# EAGLE design Robot Board ++ (EAGLE 6.4)
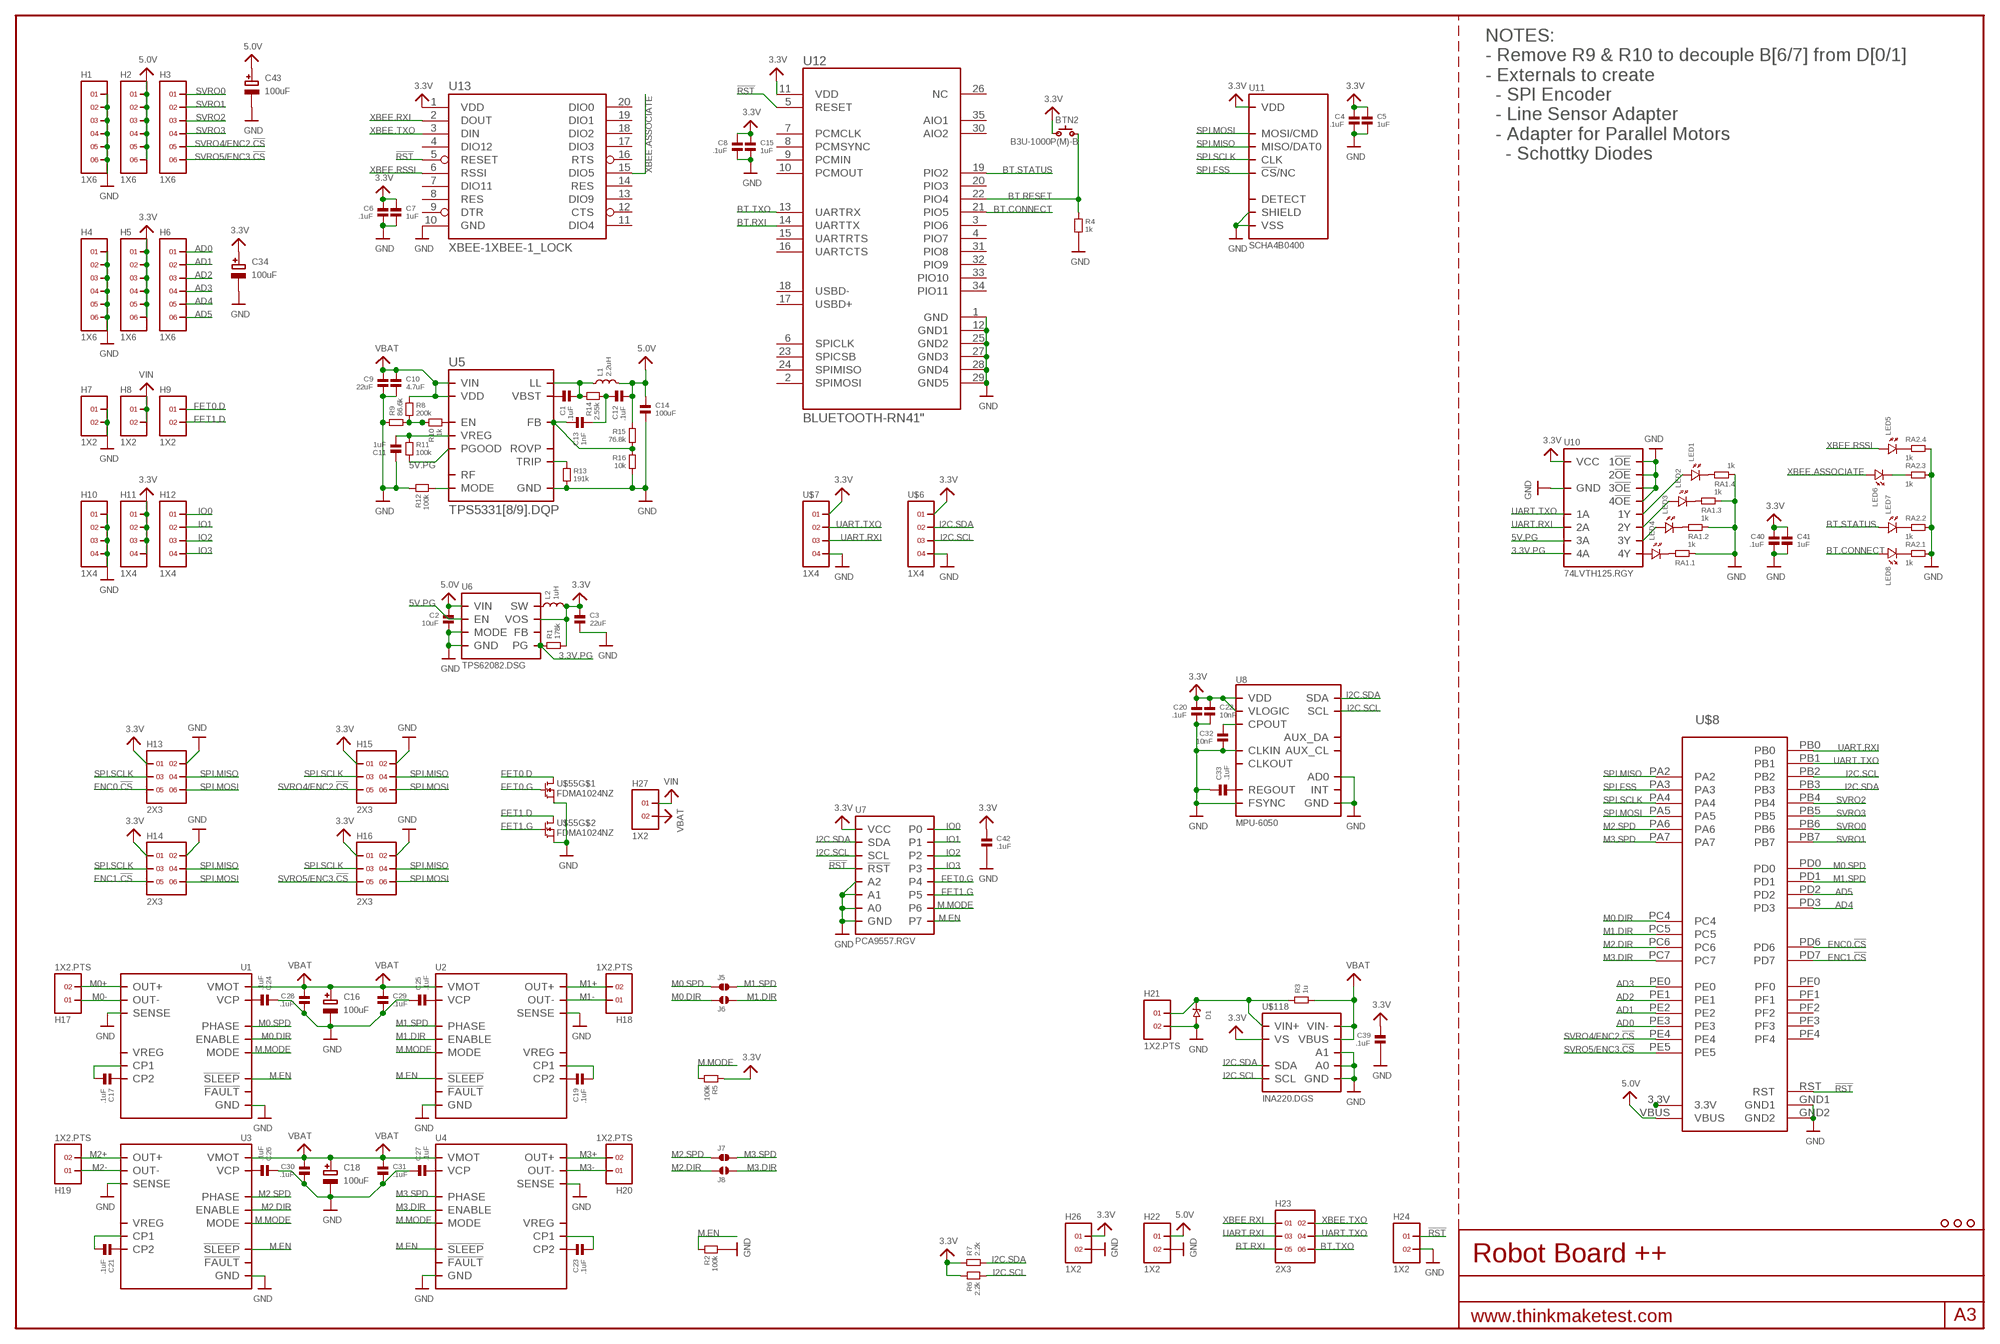
[diagram p0: schematic, sheet 1]

## Parts
BTN2  B3U-1000P(M)-B  SPST.B3U-1000P(M)-B  [B3U-1000P(M)-B]
C1  .1uF  CAPACITOR.0603  [0603]
C2  10uF  CAPACITOR.0603  [0603]
C3  22uF  CAPACITOR.0603  [0603]
C4  .1uF  CAPACITOR.0603  [0603]
C5  1uF  CAPACITOR.0603  [0603]
C6  .1uF  CAPACITOR.0603  [0603]
C7  1uF  CAPACITOR.0603  [0603]
C8  .1uF  CAPACITOR.0603  [0603]
C9  22uF  CAPACITOR.1206  [1206]
C10  4.7uF  CAPACITOR.0805  [0805]
C11  1uF  CAPACITOR.0603  [0603]
C12  .1uF  CAPACITOR.0603  [0603]
C13  1nF  CAPACITOR.0603  [0603]
C14  100uF  CAPACITOR.1210  [1210]
C15  1uF  CAPACITOR.0603  [0603]
C16  100uF  CAP_ELECTROLYTICPANASONIC_C  [PANASONIC_C]
C17  .1uF  CAPACITOR.0603  [0603]
C18  100uF  CAP_ELECTROLYTICPANASONIC_C  [PANASONIC_C]
C19  .1uF  CAPACITOR.0603  [0603]
C20  .1uF  CAPACITOR.0603  [0603]
C21  .1uF  CAPACITOR.0603  [0603]
C22  10nF  CAPACITOR.0603  [0603]
C23  .1uF  CAPACITOR.0603  [0603]
C24  .1uF  CAPACITOR.0603  [0603]
C25  .1uF  CAPACITOR.0603  [0603]
C26  .1uF  CAPACITOR.0603  [0603]
C27  .1uF  CAPACITOR.0603  [0603]
C28  .1uF  CAPACITOR.0603  [0603]
C29  .1uF  CAPACITOR.0603  [0603]
C30  .1uF  CAPACITOR.0603  [0603]
C31  .1uF  CAPACITOR.0603  [0603]
C32  10nF  CAPACITOR.0603  [0603]
C33  .1uF  CAPACITOR.0603  [0603]
C34  100uF  CAP_ELECTROLYTICPANASONIC_C  [PANASONIC_C]
C39  .1uF  CAPACITOR.0603  [0603]
C40  .1uF  CAPACITOR.0603  [0603]
C41  1uF  CAPACITOR.0603  [0603]
C42  .1uF  CAPACITOR.0603  [0603]
C43  100uF  CAP_ELECTROLYTICPANASONIC_C  [PANASONIC_C]
D1  DIODE[SCHOTKY]-SOD123W  [SOD123W]
H1  1X6  [1X6]
H2  1X6  [1X6]
H3  1X6  [1X6]
H4  1X6  [1X6]
H5  1X6  [1X6]
H6  1X6  [1X6]
H7  1X2  [1X2]
H8  1X2  [1X2]
H9  1X2  [1X2]
H10  1X4  [1X4]
H11  1X4  [1X4]
H12  1X4  [1X4]
H13  2X3  [2X3@1]
H14  2X3  [2X3@1]
H15  2X3  [2X3@1]
H16  2X3  [2X3@1]
H17  1X2.PTS  1X2.PTS.PLUG  [PTS.PLUG]
H18  1X2.PTS  1X2.PTS.PLUG  [PTS.PLUG]
H19  1X2.PTS  1X2.PTS.PLUG  [PTS.PLUG]
H20  1X2.PTS  1X2.PTS.PLUG  [PTS.PLUG]
H21  1X2.PTS  1X2.PTS.PLUG  [PTS.PLUG]
H22  1X2  [1X2]
H23  2X3  [2X3]
H24  1X2  [1X2]
H26  1X2  [1X2]
H27  1X2  [1X2]
J5  SOLDERJUMPER.2.LRG  [2.LRG]
J6  SOLDERJUMPER.2.LRG  [2.LRG]
J7  SOLDERJUMPER.2.LRG  [2.LRG]
J8  SOLDERJUMPER.2.LRG  [2.LRG]
L1  2.2uH  INDUCTOR.XAL6030  [XAL6030]
L2  1uH  INDUCTOR-SRN3015  [SRN3015]
LED1  LED.0603  [0603.LED]
LED2  LED.0603  [0603.LED]
LED3  LED.0603  [0603.LED]
LED4  LED.0603  [0603.LED]
LED5  LED.0603  [0603.LED]
LED6  LED.0603  [0603.LED]
LED7  LED.0603  [0603.LED]
LED8  LED.0603  [0603.LED]
R1  178k  RESISTOR.0603  [0603]
R2  100k  RESISTOR.0603  [0603]
R3  1u  RESISTOR.WSK  [0612]
R4  1k  RESISTOR.0603  [0603]
R5  100k  RESISTOR.0603  [0603]
R6  2.2k  RESISTOR.0603  [0603]
R7  2.2k  RESISTOR.0603  [0603]
R8  200k  RESISTOR.0603  [0603]
R9  86.6k  RESISTOR.0603  [0603]
R10  1k  RESISTOR.0603  [0603]
R11  100k  RESISTOR.0603  [0603]
R12  100k  RESISTOR.0603  [0603]
R13  191k  RESISTOR.0603  [0603]
R14  2.55k  RESISTOR.0603  [0603]
R15  76.8k  RESISTOR.0603  [0603]
R16  10k  RESISTOR.0603  [0603]
RA1  1k  RA-4.0603  [0603.4.C]
RA2  1k  RA-4.0603  [0603.4.C]
U1  DRV8800.RTY  [RTY.16]
U2  DRV8800.RTY  [RTY.16]
U3  DRV8800.RTY  [RTY.16]
U4  DRV8800.RTY  [RTY.16]
U5  TPS5331[8/9].DQP  [DQP.22]
U6  TPS62082.DSG  TPS6208X.DSG  [DSG]
U7  PCA9557.RGV  [RGV.16]
U8  MPU-6050  [QFN.24.4X4]
U10  74LVTH125.RGY  74XX125.RGY  [RGY.14]
U11  SCHA4B0400  [SCHA4B0400]
U12  BLUETOOTH-RN41"  [RN41]
U13  XBEE-1XBEE-1_LOCK  [XBEE-1_LOCK]
U$3  HOLE.4MM  [4MM]
U$4  HOLE.4MM  [4MM]
U$6  1X4  [1X4]
U$7  1X4  [1X4]
U$8  STELLARIS-LAUNCHPADSTELLARIS-LAUNCHPAD-XL  [LAUNCHPAD-XL]
U$11  HOLE.4MM  [4MM]
U$55  FDMA1024NZ  [MICROFET.2X2]
U$118  INA220.DGS  [DGS.10]

## Nets
3.3V: BTN2.2 C3.1 C4.1 C5.1 C6.1 C7.1 C8.1 C15.1 C20.1 C22.1 C34.+ C39.1 C40.1 C41.1 C42.1 H5.1 H5.2 H5.3 H5.4 H5.5 H5.6 H11.1 H11.2 H11.3 H11.4 H13.1 H14.1 H15.1 H16.1 H26.1 L2.2 R1.2 R5.1 R6.1 R7.1 U6.5(VOS) U7.14(VCC) U8.8(VLOGIC) U8.13(VDD) U10.14(VCC) U11.VDD U12.11(VDD) U13.1(VDD) U$6.1 U$7.1 U$118.6(VS)
3.3V.PG: R1.1 U6.6(PG) U10.12(4A)
5.0V: C2.1 C12.2 C14.1 C43.+ H2.1 H2.2 H2.3 H2.4 H2.5 H2.6 H22.1 L1.2 R15.1 U6.8(VIN) U$8.VBUS
5V.PG: R11.2 U5.3(PGOOD) U6.1(EN) U10.9(3A)
!RST: H24.1 U7.13(!RST) U12.5(RESET) U13.5(RESET) U$8.RST
AD0: H6.1 U$8.PE3
AD1: H6.2 U$8.PE2
AD2: H6.3 U$8.PE1
AD3: H6.4 U$8.PE0
AD4: H6.5 U$8.PD3
AD5: H6.6 U$8.PD2
BT.CONNECT: LED8.P$1 U12.21(PIO5)
BT.RESET: BTN2.1 R4.1 U12.22(PIO4)
BT.RXI: H23.5 U12.14(UARTTX)
BT.STATUS: LED7.P$1 U12.19(PIO2)
BT.TXO: H23.6 U12.13(UARTRX)
ENC0.!CS: H13.5 U$8.PD6
ENC1.!CS: H14.5 U$8.PD7
FET0.D: H9.1 U$55.6(D) U$55.PAD@1(D)
FET0.G: U7.9(P4) U$55.2(G)
FET1.D: H9.2 U$55.3(D) U$55.PAD@2(D)
FET1.G: U7.10(P5) U$55.5(G)
GND: C2.2 C3.2 C4.2 C5.2 C6.2 C7.2 C8.2 C9.2 C10.2 C11.1 C14.2 C15.2 C16.- C18.- C20.2 C22.2 C24.1 C25.1 C26.1 C27.1 C28.2 C29.2 C30.2 C31.2 C32.2 C33.1 C34.- C39.2 C40.2 C41.2 C42.2 C43.- D1.P$1 H1.1 H1.2 H1.3 H1.4 H1.5 H1.6 H4.1 H4.2 H4.3 H4.4 H4.5 H4.6 H7.1 H7.2 H10.1 H10.2 H10.3 H10.4 H13.2 H14.2 H15.2 H16.2 H21.2 H22.2 H24.2 H26.2 R2.2 R4.2 R9.1 R12.1 R13.2 R16.2 RA1.1 RA1.3 RA1.5 RA1.7 RA2.2 RA2.4 RA2.6 RA2.8 U1.2(GND) U1.7(SENSE) U1.12(GND) U1.PAD(GND) U2.2(GND) U2.7(SENSE) U2.12(GND) U2.PAD(GND) U3.2(GND) U3.7(SENSE) U3.12(GND) U3.PAD(GND) U4.2(GND) U4.7(SENSE) U4.12(GND) U4.PAD(GND) U5.PAD(GND) U6.2(GND) U6.3(MODE) U6.PAD(GND) U7.1(A0) U7.2(A1) U7.3(A2) U7.6(GND) U7.PAD(GND) U8.1(CLKIN) U8.9(AD0) U8.11(FSYNC) U8.18(GND) U10.1(1!OE) U10.4(2!OE) U10.7(GND) U10.10(3!OE) U10.13(4!OE) U10.PAD(GND) U11.GND(VSS) U11.GND@1(VSS) U11.GND@2(VSS) U11.SHIELD U11.SHIELD@1(SHIELD) U11.SHIELD@2(SHIELD) U11.SHIELD@3(SHIELD) U11.VSS U12.1(GND) U12.12(GND1) U12.25(GND2) U12.27(GND3) U12.28(GND4) U12.29(GND5) U13.10(GND) U$6.4 U$7.4 U$8.GND1 U$8.GND2 U$55.1(S) U$55.4(S) U$118.1(A1) U$118.2(A0) U$118.7(GND)
I2C.SCL: R6.2 U7.15(SCL) U8.23(SCL) U$6.3 U$8.PB2 U$118.5(SCL)
I2C.SDA: R7.2 U7.16(SDA) U8.24(SDA) U$6.2 U$8.PB3 U$118.4(SDA)
IO0: H12.1 U7.4(P0)
IO1: H12.2 U7.5(P1)
IO2: H12.3 U7.7(P2)
IO3: H12.4 U7.8(P3)
M0+: H17.2 U1.6(OUT+)
M0-: H17.1 U1.9(OUT-)
M0.DIR: J6.1 U1.4(ENABLE) U$8.PC4
M0.SPD: J5.1 U1.1(PHASE) U$8.PD0
M1+: H18.2 U2.6(OUT+)
M1-: H18.1 U2.9(OUT-)
M1.DIR: J6.2 U2.4(ENABLE) U$8.PC5
M1.SPD: J5.2 U2.1(PHASE) U$8.PD1
M2+: H19.2 U3.6(OUT+)
M2-: H19.1 U3.9(OUT-)
M2.DIR: J8.1 U3.4(ENABLE) U$8.PC6
M2.SPD: J7.1 U3.1(PHASE) U$8.PA6
M3+: H20.2 U4.6(OUT+)
M3-: H20.1 U4.9(OUT-)
M3.DIR: J8.2 U4.4(ENABLE) U$8.PC7
M3.SPD: J7.2 U4.1(PHASE) U$8.PA7
M.EN: R2.1 U1.3(!SLEEP) U2.3(!SLEEP) U3.3(!SLEEP) U4.3(!SLEEP) U7.12(P7)
M.MODE: R5.2 U1.16(MODE) U2.16(MODE) U3.16(MODE) U4.16(MODE) U7.11(P6)
N$1: U$8.3.3V
N$2: C1.1 U5.4(VBST)
N$3: R12.2 U5.20(MODE)
N$4: C11.2 R11.1 U5.18(VREG)
N$5: R13.1 U5.21(TRIP)
N$6: LED1.P$1 U10.3(1Y)
N$7: C33.2 U8.10(REGOUT)
N$8: R10.2 U5.2(EN)
N$9: LED8.P$2 RA2.1
N$10: C13.1 R15.2 R16.1 U5.1(FB)
N$11: R8.2 R9.2 R10.1
N$12: L2.1 U6.7(SW)
N$13: C17.1 U1.11(CP2)
N$14: C12.1 C13.2 R14.2
N$15: C1.2 L1.1 R14.1 U5.6(LL) U5.7(LL) U5.8(LL) U5.9(LL) U5.10(LL) U5.11(LL)
N$18: C24.2 U1.13(VCP)
N$19: C25.2 U2.13(VCP)
N$20: C26.2 U3.13(VCP)
N$21: C27.2 U4.13(VCP)
N$22: D1.P$2 H21.1 R3.1@1 R3.1@2 U$118.10(VIN+)
N$24: C32.1 U8.20(CPOUT)
N$25: C19.1 U2.11(CP2)
N$27: C21.1 U3.11(CP2)
N$29: C23.1 U4.11(CP2)
N$37: C21.2 U3.10(CP1)
N$38: C17.2 U1.10(CP1)
N$39: C19.2 U2.10(CP1)
N$40: C23.2 U4.10(CP1)
N$43: LED2.P$1 U10.6(2Y)
N$44: LED4.P$1 U10.11(4Y)
N$46: LED7.P$2 RA2.3
N$47: LED6.P$2 RA2.5
N$48: LED5.P$2 RA2.7
N$49: LED4.P$2 RA1.2
N$50: LED3.P$1 U10.8(3Y)
N$51: LED1.P$2 RA1.8
N$52: LED2.P$2 RA1.6
N$53: LED3.P$2 RA1.4
SPI.FSS: U11.!CS!/NC/DAT3(!CS!/NC) U$8.PA3
SPI.MISO: H13.4 H14.4 H15.4 H16.4 U11.MISO/DAT0 U$8.PA2
SPI.MOSI: H13.6 H14.6 H15.6 H16.6 U11.MOSI/CMD U$8.PA5
SPI.SCLK: H13.3 H14.3 H15.3 H16.3 U11.CLK U$8.PA4
SVRO0: H3.1 U$8.PB6
SVRO1: H3.2 U$8.PB7
SVRO2: H3.3 U$8.PB4
SVRO3: H3.4 U$8.PB5
SVRO4/ENC2.!CS: H3.5 H15.5 U$8.PE4
SVRO5/ENC3.!CS: H3.6 H16.5 U$8.PE5
UART.RXI: H23.3 U10.5(2A) U$7.3 U$8.PB0
UART.TXO: H23.4 U10.2(1A) U$7.2 U$8.PB1
VBAT: C9.1 C10.1 C16.+ C18.+ C28.1 C29.1 C30.1 C31.1 H27.2 R3.2@1 R3.2@2 R8.1 U1.8(VMOT) U2.8(VMOT) U3.8(VMOT) U4.8(VMOT) U5.12(VIN) U5.13(VIN) U5.14(VIN) U5.15(VIN) U5.16(VIN) U5.17(VIN) U5.19(VDD) U$118.8(VBUS) U$118.9(VIN-)
VIN: H8.1 H8.2 H27.1
XBEE.ASSOCIATE: LED6.P$1 U13.15(DIO5)
XBEE.RSSI: LED5.P$1 U13.6(RSSI)
XBEE.RXI: H23.1 U13.2(DOUT)
XBEE.TXO: H23.2 U13.3(DIN)
Unconnected: U1.14(VREG) U1.15(!FAULT) U2.14(VREG) U2.15(!FAULT) U3.14(VREG) U3.15(!FAULT) U4.14(VREG) U4.15(!FAULT) U5.5(ROVP) U5.22(RF) U6.4(FB) U8.6(AUX_DA) U8.7(AUX_CL) U8.12(INT) U8.22(CLKOUT) U11.CD(DETECT) U12.2(SPIMOSI) U12.3(PIO6) U12.4(PIO7) U12.6(SPICLK) U12.7(PCMCLK) U12.8(PCMSYNC) U12.9(PCMIN) U12.10(PCMOUT) U12.15(UARTRTS) U12.16(UARTCTS) U12.17(USBD+) U12.18(USBD-) U12.20(PIO3) U12.23(SPICSB) U12.24(SPIMISO) U12.26(NC) U12.30(AIO2) U12.31(PIO8) U12.32(PIO9) U12.33(PIO10) U12.34(PIO11) U12.35(AIO1) U13.4(DIO12) U13.7(DIO11) U13.8(RES) U13.9(DTR) U13.11(DIO4) U13.12(CTS) U13.13(DIO9) U13.14(RES) U13.16(RTS) U13.17(DIO3) U13.18(DIO2) U13.19(DIO1) U13.20(DIO0) U$8.PF0 U$8.PF1 U$8.PF2 U$8.PF3 U$8.PF4

## Notes on the sheet
- NOTES:
  - Remove R9 & R10 to decouple B[6/7] from D[0/1]
  - Externals to create
    - SPI Encoder
    - Line Sensor Adapter
    - Adapter for Parallel Motors
      - Schottky Diodes

## Library data of the parts
BTN2 = omron:SPST
C1-C15 C17 C19-C33 C39-C42 = standardparts:CAPACITOR
C16 C18 C34 C43 = microbuilder:CAP_ELECTROLYTIC: Electrolytic Capacitors SMT PANASONIC_C - Size C Panasonic Electrolytic Aluminum Capacitor 47µF 16V 20% Electrolytic Capacitor [Digikey: PCE3890TR-ND] PANASONIC_D - Size D Panasonic Electrolytic Aluminum Capacitor 100µF 25V 20% Electrolytic Capacitor [Digikey: PCE3898TR-ND] PTH 3.5 mm grid, 8 mm diameter ... 3.5 mm grid, 10 mm diameter ...
D1 = nxp:DIODE[SCHOTKY]
H1-H6 = headers(.1in):1X6
H7-H9 H22 H24 H26 H27 = headers(.1in):1X2
H10-H12 U$6 U$7 = headers(.1in):1X4
H13-H16 = headers(.1in):2X3
H17-H21 = phoenixcontact:1X2
H23 = headers(2mm):2X3
J5-J8 = solderjumper:SOLDERJUMPER.2
L1 = coilcraft:INDUCTOR
L2 = bourns:INDUCTOR
LED1-LED8 = standardparts:LED
R1 R2 R4-R16 = standardparts:RESISTOR
R3 = vishay:RESISTOR
RA1 RA2 = resistorarray:RA-4: Dimentions sources from here: http://www.ctscorp.com/components/Datasheets/CTSChipArrayDs.pdf
U1-U4 = packages(ti):DRV8800
U5 = packages(ti):TPS5331[8/9]
U6 = packages(ti):TPS6208X
U7 = packages(ti):PCA9557
U8 = invensense:MPU-6050
U10 = packages(ti):74XX125
U11 = alps:SCHA4B0400
U12 = SparkFun-RF:BLUETOOTH-RN41: Bluetooth SMD module
U13 = SparkFun-RF:XBEE-1: Xbee module footprints SMT header is CONN-09042.
U$3 U$4 U$11 = screw_holes:HOLE
U$8 = StellarisLaunchPad_Fred:STELLARIS-LAUNCHPAD
U$55 = freescale:FDMA1024NZ
U$118 = packages(ti):INA220

## Board
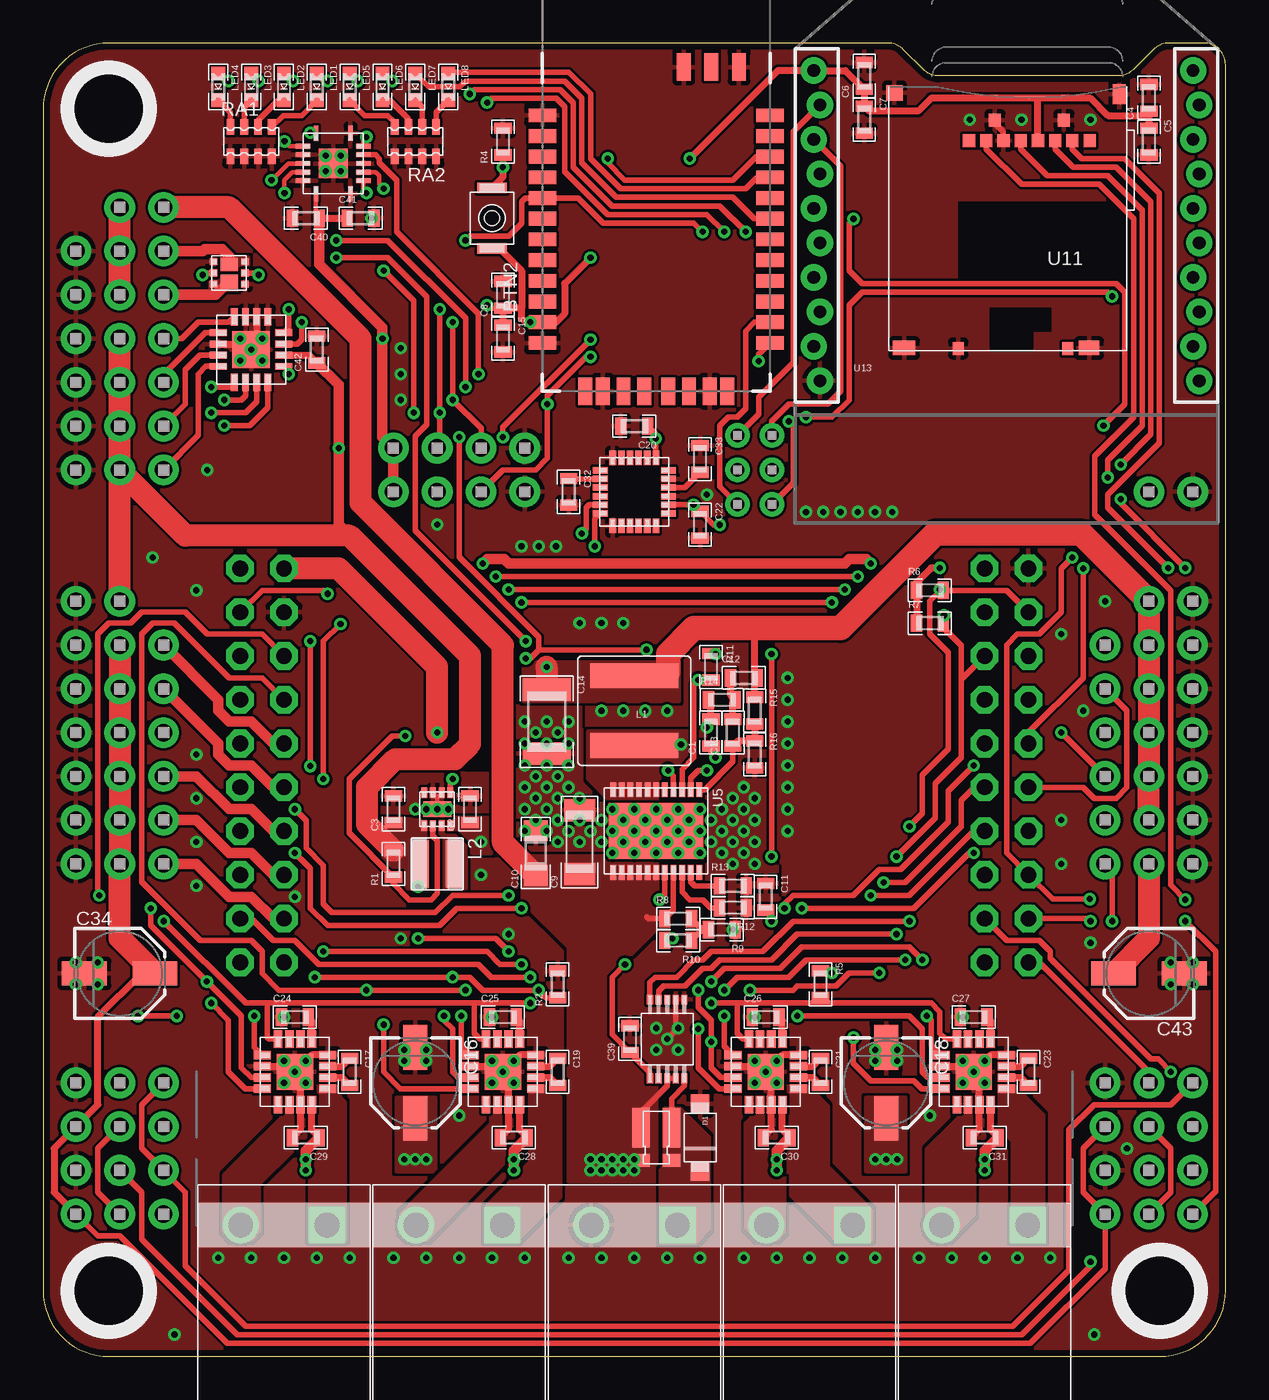
[diagram p1: board, top side]
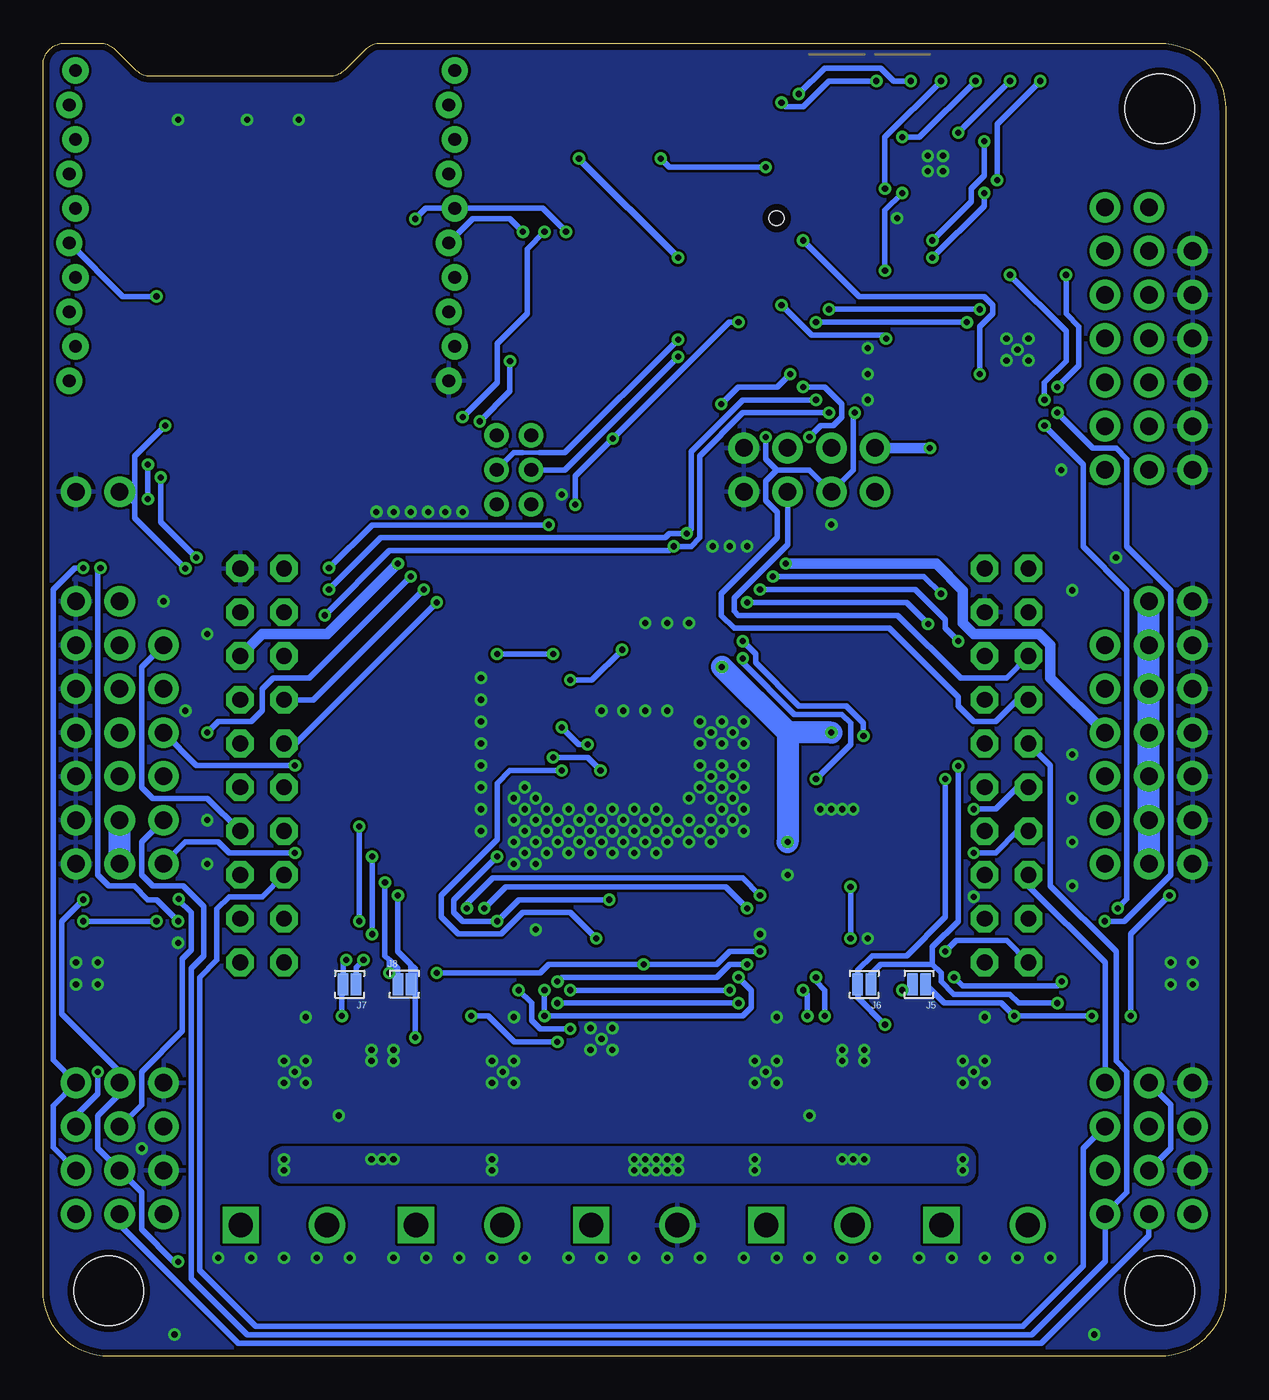
[diagram p2: board, bottom side, seen from below]

Size 68.58 x 76.2 mm. Coordinates in mm from the lower left corner, seen from the top.
Outline: 67.31,76.2 65.3,76.2 arc45 64.4,75.83 63.24,74.67 arc-45 62.34,74.3 51.96,74.3 arc-45 51.06,74.67 49.9,75.83 arc45 49,76.2 3.81,76.2 arc90 0,72.39 0,3.81 arc90 3.81,0 64.77,0 arc90 68.58,3.81 68.58,74.93 arc90 67.31,76.2
Copper layers (1*16): Top 0.0356mm / dielectric 1.5011mm / Bottom 0.0356mm
Design rules "OSHPark": minimum track width 6mil, minimum drill 13mil, track to track 6mil, track to pad 6mil, pad to pad 6mil, via to via 6mil, smd to smd 6mil, copper to edge 15mil, drill to drill 6mil, minimum pad ring 7mil, minimum via ring 7mil, stop-mask expansion 4mil, vias tented up to drill 16mil, thermal gap 10mil
tRestrict: 3 lines

### Footprints (pad centres in the part's own frame; a part is rotated, then mirrored left to right if it is on the bottom)
B3U-1000P(M)-B = smd 0.6 x 1.7: 1 -1.75,0; 2 1.75,0 | hole 0.85: 0,0
0603 = smd 0.65 x 1: 1 -0.775,0; 2 0.775,0
1206 = smd 1.3 x 1.8: 1 -1.85,0; 2 1.85,0
0805 = smd 1.2 x 1.4: 1 -1.3,0; 2 1.3,0
1210 = smd 1.3 x 2.8: 1 -1.85,0; 2 1.85,0
PANASONIC_C = smd 2.6 x 1.4: + 2.05,0; - -2.05,0
SOD123W = smd 1.1 x 1.1: P$1 -1.95,0; P$2 1.95,0
1X6 = drill 1.016 pad 1.778: 1 0,0; 2 2.54,0; 3 5.08,0; 4 7.62,0; 5 10.16,0; 6 12.7,0
1X2 = drill 1.016 pad 1.778: 1 0,0; 2 2.54,0
1X4 = drill 1.016 pad 1.778: 1 0,0; 2 2.54,0; 3 5.08,0; 4 7.62,0
2X3 = drill 1.016 pad 1.778: 1 0,0; 2 0,2.54; 3 2.54,0; 4 2.54,2.54; 5 5.08,0; 6 5.08,2.54
PTS.PLUG = drill 1.4 square: 1 -2.5,0 | drill 1.4: 2 2.5,0
2X3' = drill 0.8 pad 1.422: 1 -2,-1; 2 -2,1; 3 0,-1; 4 0,1; 5 2,-1; 6 2,1
2.LRG = smd 0.61 x 1.27: 1 -0.381,0; 2 0.381,0
XAL6030 = smd 1.43 x 5.12: 1 -2.02,0; 2 2.02,0
SRN3015 = smd 2.7 x 1: 1 0,1; 2 0,-1
0603.LED = smd 0.8 x 0.8: P$1 -0.775,0; P$2 0.775,0
0612 = smd 2.286 x 1.016: 1@1 -0.572,0.889; 2@1 -0.572,-0.889 | smd 0.762 x 1.016: 1@2 1.333,0.889; 2@2 1.333,-0.889
0603.4.C = smd 0.45 x 0.9: 1 -1.2,-0.85; 2 -1.2,0.85; 3 -0.4,-0.85; 4 -0.4,0.85; 5 0.4,-0.85; 6 0.4,0.85; 7 1.2,-0.85; 8 1.2,0.85
RTY.16 = smd 1 x 0.5: 1 -1.9,0.975; 2 -1.9,0.325; 3 -1.9,-0.325; 4 -1.9,-0.975; 9 1.9,-0.975; 10 1.9,-0.325; 11 1.9,0.325; 12 1.9,0.975 | smd 0.5 x 1: 5 -0.975,-1.9; 6 -0.325,-1.9; 7 0.325,-1.9; 8 0.975,-1.9; 13 0.975,1.9; 14 0.325,1.9; 15 -0.325,1.9; 16 -0.975,1.9 | smd 2.1 x 2.1: PAD 0,0
DQP.22 = smd 0.34 x 0.85: 1 -2.5,-2.395; 2 -2,-2.395; 3 -1.5,-2.395; 4 -1,-2.395; 5 -0.5,-2.395; 6 0,-2.395; 7 0.5,-2.395; 8 1,-2.395; 9 1.5,-2.395; 10 2,-2.395; 11 2.5,-2.395; 12 2.5,2.395; 13 2,2.395; 14 1.5,2.395; 15 1,2.395; 16 0.5,2.395; 17 0,2.395; 18 -0.5,2.395; 19 -1,2.395; 20 -1.5,2.395; 21 -2,2.395; 22 -2.5,2.395 | smd 5.48 x 3.24: PAD 0,0
DSG = smd 0.6 x 0.35: 1 -0.95,0.75; 2 -0.95,0.25; 3 -0.95,-0.25; 4 -0.95,-0.75; 5 0.95,-0.75; 6 0.95,-0.25; 7 0.95,0.25; 8 0.95,0.75 | smd 0.9 x 1.6: PAD 0,0
RGV.16 = smd 1 x 0.4: 1 -1.9,0.975; 2 -1.9,0.325; 3 -1.9,-0.325; 4 -1.9,-0.975; 9 1.9,-0.975; 10 1.9,-0.325; 11 1.9,0.325; 12 1.9,0.975 | smd 0.4 x 1: 5 -0.975,-1.9; 6 -0.325,-1.9; 7 0.325,-1.9; 8 0.975,-1.9; 13 0.975,1.9; 14 0.325,1.9; 15 -0.325,1.9; 16 -0.975,1.9 | smd 2.16 x 2.16: PAD 0,0
QFN.24.4X4 = smd 0.85 x 0.38: 1 -1.975,1.25; 2 -1.975,0.75; 3 -1.975,0.25; 4 -1.975,-0.25; 5 -1.975,-0.75; 6 -1.975,-1.25; 13 1.975,-1.25; 14 1.975,-0.75; 15 1.975,-0.25; 16 1.975,0.25; 17 1.975,0.75; 18 1.975,1.25 | smd 0.38 x 0.85: 7 -1.25,-1.975; 8 -0.75,-1.975; 9 -0.25,-1.975; 10 0.25,-1.975; 11 0.75,-1.975; 12 1.25,-1.975; 19 1.25,1.975; 20 0.75,1.975; 21 0.25,1.975; 22 -0.25,1.975; 23 -0.75,1.975; 24 -1.25,1.975
RGY.14 = smd 0.85 x 0.28: 1 -1.755,-1; 7 1.755,-1; 8 1.755,1; 14 -1.755,1 | smd 0.28 x 0.85: 2 -1,-1.755; 3 -0.5,-1.755; 4 0,-1.755; 5 0.5,-1.755; 6 1,-1.755; 9 1,1.755; 10 0.5,1.755; 11 0,1.755; 12 -0.5,1.755; 13 -1,1.755 | smd 1.7 x 1.7: PAD 0,0
SCHA4B0400 = smd 0.7 x 0.75: !CS!/NC/DAT3 3.163,3.125; CLK 6.162,3.125; GND 3.663,1.925; GND@1 7.662,1.925; MISO/DAT0 8.162,3.125; MOSI/CMD 4.162,3.125; NC/NC/DAT1 9.162,3.125; NC/NC/DAT2 2.163,3.125; VDD 5.162,3.125; VSS 7.162,3.125 | smd 0.65 x 0.75: CD 3.438,15.175; GND@2 9.787,15.175 | smd 0.745 x 1.15: SHIELD 0.453,0.425 | smd 0.95 x 0.9: SHIELD@1 13.488,0.35 | smd 1.3 x 0.85: SHIELD@2 12.925,15.15 | smd 1.2 x 0.85: SHIELD@3 2.2,15.15
RN41 = smd 0.8 x 1.6: 1 -6.6,-6.6; 2 -5.4,-6.6; 3 -4.2,-6.6; 4 -3,-6.6; 5 -1.8,-6.6; 6 -0.6,-6.6; 7 0.6,-6.6; 8 1.8,-6.6; 9 3,-6.6; 10 4.2,-6.6; 11 5.4,-6.6; 12 6.6,-6.6; 13 6.6,6.6; 14 5.4,6.6; 15 4.2,6.6; 16 3,6.6; 17 1.8,6.6; 18 0.6,6.6; 19 -0.6,6.6; 20 -1.8,6.6; 21 -3,6.6; 22 -4.2,6.6; 23 -5.4,6.6; 24 -6.6,6.6 | smd 1.6 x 0.8: 25 -9.4,4.8; 26 -9.4,3.2; 27 -9.4,1.6; 28 9.4,3.1; 29 9.4,-3.1; 30 9.4,-4.122; 31 9.4,-1.9; 32 9.4,-0.7; 33 9.4,0.7; 34 9.4,1.9; 35 9.4,4.122
XBEE-1_LOCK = drill 0.737 pad 1.524: 1 -11.178,20; 2 -10.822,18; 3 -11.178,16; 4 -10.822,14; 5 -11.178,12; 6 -10.822,10; 7 -11.178,8; 8 -10.822,6; 9 -11.178,4; 10 -10.822,2; 11 11.178,2; 12 10.822,4; 13 11.178,6; 14 10.822,8; 15 11.178,10; 16 10.822,12; 17 11.178,14; 18 10.822,16; 19 11.178,18; 20 10.822,20
4MM = hole 4: 0,0
LAUNCHPAD-XL = drill 0.914 pad 1.6 octagon: 3.3V 30.48,2.54; GND1 33.02,5.08; GND2 30.48,48.26; PA2 53.34,48.26; PA3 50.8,48.26; PA4 48.26,48.26; PA5 48.26,2.54; PA6 50.8,2.54; PA7 53.34,2.54; PB0 35.56,2.54; PB1 38.1,2.54; PB2 33.02,48.26; PB3 35.56,45.72; PB4 45.72,2.54; PB5 33.02,2.54; PB6 45.72,48.26; PB7 43.18,48.26; PC4 38.1,45.72; PC5 40.64,45.72; PC6 43.18,45.72; PC7 45.72,45.72; PD0 35.56,5.08; PD1 38.1,5.08; PD2 40.64,5.08; PD3 43.18,5.08; PD6 48.26,45.72; PD7 50.8,45.72; PE0 35.56,48.26; PE1 45.72,5.08; PE2 48.26,5.08; PE3 50.8,5.08; PE4 40.64,2.54; PE5 43.18,2.54; PF0 38.1,48.26; PF1 53.34,5.08; PF2 30.48,45.72; PF3 33.02,45.72; PF4 53.34,45.72; RST 40.64,48.26; VBUS 30.48,5.08
MICROFET.2X2 = smd 0.42 x 0.42: 1 -0.65,-0.915; 2 0,-0.915; 3 0.65,-0.915; 4 0.65,0.915; 5 0,0.915; 6 -0.65,0.915 | smd 0.8 x 1: PAD@1 -0.5,0; PAD@2 0.5,0
DGS.10 = smd 0.36 x 0.57: 1 -1,-2.285; 2 -0.5,-2.285; 3 0,-2.285; 4 0.5,-2.285; 5 1,-2.285; 6 1,2.285; 7 0.5,2.285; 8 0,2.285; 9 -0.5,2.285; 10 -1,2.285

### Placement (x,y rotation side)
BTN2  26.04,66.04 270 top
C1  38.73,36.2 90 top
C2  24.77,31.75 90 top
C3  20.32,31.75 90 top
C4  64.14,73.03 90 top
C5  64.14,70.48 270 top
C6  47.62,74.3 90 top
C7  47.62,71.75 270 top
C8  26.67,61.59 90 top
C9  31.11,29.84 90 top
C10  28.57,29.21 90 top
C11  41.91,26.67 270 top
C12  40.64,39.37 0 top
C13  40.01,36.2 90 top
C14  29.21,36.83 270 top
C15  26.67,59.05 270 top
C16  21.59,15.88 270 top
C17  17.78,16.51 270 top
C18  48.9,15.88 270 top
C19  29.84,16.51 270 top
C20  34.29,53.98 180 top
C21  45.09,16.51 270 top
C22  38.1,48.26 270 top
C23  57.15,16.51 270 top
C24  14.61,19.68 0 top
C25  26.67,19.68 0 top
C26  41.91,19.68 0 top
C27  53.98,19.68 0 top
C28  27.3,12.7 180 top
C29  15.24,12.7 180 top
C30  42.55,12.7 180 top
C31  54.61,12.7 180 top
C32  30.48,50.16 270 top
C33  38.1,52.07 270 top
C34  4.45,22.23 0 top
C39  34.04,18.41 90 top
C40  15.24,66.04 180 top
C41  18.41,66.04 0 top
C42  15.88,58.42 90 top
C43  64.14,22.23 180 top
D1  38.1,12.7 270 top
H1  66.67,28.57 90 top
H2  64.14,28.57 90 top
H3  61.59,41.27 270 top
H4  1.91,28.57 90 top
H5  4.45,28.57 90 top
H6  6.99,28.57 90 top
H7  1.91,61.59 90 top
H8  4.45,61.59 90 top
H9  6.99,64.14 270 top
H10  1.91,51.44 90 top
H11  4.45,51.44 90 top
H12  6.99,59.05 270 top
H13  2X3  [2X3]  1.91,13.34 0 top
H14  2X3  [2X3]  61.59,13.34 0 top
H15  2X3  [2X3]  1.91,8.26 0 top
H16  2X3  [2X3]  61.59,8.26 0 top
H17  13.97,7.62 180 top
H18  24.13,7.62 180 top
H19  44.45,7.62 180 top
H20  54.61,7.62 180 top
H21  34.29,7.62 180 top
H22  64.14,43.81 0 top
H23  2X3  [2X3']  41.27,51.44 270 top
H24  64.14,50.16 0 top
H26  4.45,43.81 180 top
H27  4.45,66.67 0 top
J5  17.78,21.59 180 bottom
J6  20.95,21.59 180 bottom
J7  50.8,21.59 180 bottom
J8  47.62,21.59 0 bottom
L1  34.29,37.47 90 top
L2  22.86,28.57 270 top
LED1  15.88,73.66 270 top
LED2  13.97,73.66 270 top
LED3  12.06,73.66 270 top
LED4  10.16,73.66 270 top
LED5  17.78,73.66 270 top
LED6  19.68,73.66 270 top
LED7  21.59,73.66 270 top
LED8  23.5,73.66 270 top
R1  20.32,28.57 90 top
R2  29.84,21.59 90 top
R3  35.56,12.7 270 top
R4  26.67,70.48 90 top
R5  45.09,21.59 270 top
R6  51.44,44.45 0 top
R7  51.44,42.55 0 top
R8  36.83,25.4 0 top
R9  39.37,24.77 180 top
R10  36.83,24.13 180 top
R11  38.73,40.01 270 top
R12  40.01,26.04 180 top
R13  40.01,27.3 0 top
R14  39.37,38.1 0 top
R15  41.27,37.47 270 top
R16  41.27,34.92 270 top
RA1  12.06,70.48 0 top
RA2  21.59,70.48 180 top
U1  14.61,16.51 0 top
U2  26.67,16.51 0 top
U3  41.91,16.51 0 top
U4  53.98,16.51 0 top
U5  35.56,30.48 180 top
U6  22.86,31.75 270 top
U7  12.06,58.42 270 top
U8  34.29,50.16 90 top
U10  16.83,69.22 90 top
U11  62.87,73.66 180 top
U12  35.56,65.41 270 top
U13  55.88,54.61 0 top
U$3  3.81,3.81 0 top
U$4  64.77,3.81 0 top
U$6  20.32,52.7 0 top
U$7  20.32,50.16 0 top
U$8  8.89,76.2 270 top
U$11  3.81,72.39 0 top
U$55  10.79,62.87 270 top
U$118  36.2,18.41 180 top

### Tracks (layer width: path | path; a pad name or v marks a point on that pad's centre or on a via)
3.3V  (via drill 0.36)
  Top 0.254: U10.14 15.83,66.23 C40.1
  Top 0.305: H15.1 3.17,6.99 4.45,6.99 10.68,0.75 57.25,0.75 61.59,5.09 H16.1 60.33,9.53 60.33,12.06 H14.1 | U$118.6 35.2,16.48 C39.1 33,18.68 33,22 v33.75,22.75 | v45.75,22.25 45.2,22.25 R5.1 | v27,23.5 26.25,24.25 v21.75,24.25 | v21.75,27.25 21.75,28.46 L2.2 | U8.13 v35.54,53.25 35.54,53.5 C20.1 | U8.8 v37.72,49.41 C22.1 38.88,48.25 v39.25,48.25 | v25.75,61 25.93,60.82 27.25,60.82
  Top 0.406: C34.+ 5.71,22.23 3.17,19.68 3.17,14.61 H13.1 0.64,12.06 0.64,9.53 H15.1 | U7.14 15.43,58.09 C42.1 | R7.1 R6.1 50.66,44.91 51.5,45.75 v52,45.75 | C6.1 C7.1 47.91,72.25 50.75,72.25 51.5,73 57.75,73 | C6.1 46.53,74.61 U13.1 42.61,74.61 v37.5,69.5 | C15.1 C8.1 27.25,60.82 27.75,60.82 | BTN2.2 26.46,64.29 27.75,63 27.75,60.82 | 27.75,60.82 27.75,60.26 28,60.01 v28.25,60.01 U12.11 29.75,60.01 30.25,60.5 30.25,62.25 v31.75,63.75 | 47.65,73.5 C6.1 | C40.1 C41.1 | 57.75,73 60.75,73 61.75,72 63.88,72 C4.1 C5.1 | U11.VDD 57.7,72.95 57.75,73
  Top 0.61: U$7.1 U$6.1 19.68,53.34 v19.68,59.05 19.68,59.69 16.02,63.36 C40.1 | 18.1,47.31 17.14,48.26 v17.14,52.7 17.14,56.38 C42.1
  Top 1.27: H11.1 H11.2 H11.3 H11.4 | H26.1 H11.1 | C34.+ 4.45,24.27 H5.1 | R1.2 18.8,30.87 18.8,33.02 20.43,34.66 23.88,34.66 24.77,35.54 24.77,40.64 18.1,47.31 17.78,47.62 8.26,47.62 H11.1 | H5.6 4.45,28.55 4.5,28.5
  Bottom 0.305: v45.75,22.25 39.75,22.25 39.25,22.75 v33.75,22.75 29.5,22.75 28.75,23.5 v27,23.5 | v21.75,24.25 v21.75,27.25 | v37.72,49.41 37.72,51.07 v35.54,53.25 28.79,60.01 v28.25,60.01 | v52,45.75 49.5,48.25 v39.25,48.25 | v19.68,59.05 19.88,59.25 24,59.25 v25.75,61
  Bottom 0.406: v37.5,69.5 v31.75,63.75
  Bottom 0.61: U$6.1 v17.14,52.7
  Bottom 1.27: H5.1 H5.2 H5.3 H5.4 H5.5 H5.6 H26.1
  pour Top (no thermals): 22.25,31.15 22.25,27.15 21,27.15 19.75,28.4 19.75,31.15
3.3V.PG  (via drill 0.36)
  Top 0.254: U10.12 14.46,68.72 14,68.25 v14,67.5
  Top 0.305: U6.6 22.61,30.2 22.86,29.95 22.86,26.86 22.5,26.5 21.25,26.5 20.32,27.43 R1.1 17.75,30.37 17.75,33.5 20.25,36 v21,36 | v28,41.5 21.59,47.91 21.59,53.41 22.25,54.07 22.25,61.5 20,63.75 v17,63.75
  Bottom 0.305: v21,36 21,36.75 22,37.75 24.75,37.75 27.25,40.25 27.25,40.75 v28,41.5 | v17,63.75 14,66.75 v14,67.5
5.0V  (via drill 0.36)
  Top 0.406: R15.1 41.27,39.23 | 41.27,39.23 C12.2 | 41.27,39.23 41.27,42.02 41.5,42.25
  Top 1.27: H22.1 H2.6 H2.5 H2.4 H2.3 H2.2 | H2.1 64.14,24.27 C43.+ | v29.21,40.01 C14.1 | v22.86,36.2 22.86,40.01 17.14,45.72 U$8.VBUS
  Top 1.422: H22.1 60.2,47.75 51.75,47.75 46.25,42.25 41.5,42.25 37.75,42.25 36.25,40.75 36.25,39.75
  Bottom 1.27: H2.1 H2.2 | v22.86,36.2 25.4,36.2 | 25.4,36.2 v29.21,40.01 | 25.4,36.2 v25.4,29.84
  pour Top (no thermals): 27.86,40.27 36.87,40.27 36.87,38.02 27.86,38.02
  pour Top (no thermals): 23.55,30.61 24.13,30.61 24.89,29.84 24.89,29.21 26.04,29.21 26.04,31.24 23.55,31.24
5V.PG  (via drill 0.36)
  Top 0.254: U10.9 14.29,70.22 v14,70.5
  Top 0.305: U6.1 23.61,33.36 v23.75,33.5 | v28,40.5 28.25,40.5 28.75,41 | 28.75,41 v35,41 | 28.75,41 28.75,41.75 24.13,46.37 v24.13,53.34 | v24.5,56.25 24.5,60.25 20,64.75 v17,64.75 | U5.3 37.06,34.06 37.75,34.75 37.75,39 v38,39.25 38.02,39.23 R11.2
  Bottom 0.305: v23.75,33.5 21.75,35.5 21.75,36.75 22.25,37.25 25,37.25 28,40.25 v28,40.5 | v24.5,56.25 23.25,56.25 22.25,55.25 22.25,54.5 22.75,54 23.47,54 v24.13,53.34 | v17,64.75 14.75,67 14.75,67.75 14,68.5 v14,70.5 | v35,41 36.75,39.25 v38,39.25
!RST  (via drill 0.36)
  Top 0.305: U$8.RST 57.15,36.2 60.33,39.37 v60.33,45.72 | v61.5,54 62.75,55.25 62.75,61.75 62.25,62.25 47.5,62.25 46.75,63 46.75,65.75 v47,66 | v38.25,65.25 37.75,65.75 32.5,65.75 31.05,67.2 U12.5 27.95,67.2 27.75,67 27.75,65.75 27,65 24.75,65 v24.5,64.75 | U7.13 14.25,57.16 v14.25,57
  Bottom 0.305: v60.33,45.72 63.25,48.65 63.25,49.5 | v47,66 46.39,66.61 U13.5 39.61,66.61 v38.25,65.25 | v14.25,57 14.25,59.75 13.5,60.5 13.5,61 14,61.5 21.25,61.5 v24.5,64.75 | v61.5,54 63.25,52.25 63.25,49.5 | H24.1 63.91,50.16 63.25,49.5
AD0
  Top 0.61: U$8.PE3 13.34,25.4 12.06,26.67 10.79,26.67 8.89,28.57 H6.1
AD1
  Top 0.61: U$8.PE2 13.34,27.94 12.06,29.21 10.79,29.21 8.89,31.11 H6.2
AD2
  Top 0.61: U$8.PE1 13.34,30.48 12.06,31.75 10.79,31.75 8.89,33.66 H6.3
AD3  (via drill 0.36)
  Top 0.61: v25.5,46 25.75,46.25 26.75,46.25 27,46 46.5,46 46.75,46.25 47.75,46.25 v48,46
  Bottom 0.61: H6.4 10.16,39.37 10.16,41.27 10.79,41.91 14.61,41.91 15.24,42.55 15.24,44.45 16.79,46 v25.5,46 | U$8.PE0 55.88,41.91 52.09,41.91 v48,46
AD4
  Top 0.61: U$8.PD3 13.34,33.02 12.06,34.29 10.79,34.29 10.16,34.92 10.16,35.56 H6.5
AD5
  Top 0.61: U$8.PD2 13.34,35.56 12.06,36.83 10.79,36.83 10.16,37.47 10.16,38.1 H6.6
BT.CONNECT
  Top 0.305: LED8.P$1 23.56,74.5 30.5,74.5 31.75,73.25 31.75,69.5 33.5,67.75 40.75,67.75 41.41,68.41 U12.21
BT.RESET  (via drill 0.36)
  Top 0.305: U12.22 41.35,69.61 40,68.25 33.75,68.25 32.75,69.25 v32.75,69.5
  Top 0.406: R4.1 v26.67,69 26.67,68.42 BTN2.1
  Bottom 0.305: v32.75,69.5 32.25,69 v26.67,69
BT.RXI
  Top 0.305: U12.14 41.26,60.01 40.75,59.5 40.75,55 40.25,54.5 39.75,54.5 39.25,54 39.25,50.46 H23.5
BT.STATUS
  Top 0.305: LED7.P$1 22.36,73.66 24.16,73.66 24.5,74 30.25,74 31.25,73 31.25,69.25 33.25,67.25 40,67.25 41.24,66 U12.19
BT.TXO  (via drill 0.36)
  Top 0.305: v43.25,54.25 43.5,54 43.5,50.66 H23.6 | v41.5,57.75 41.5,58.15 U12.13
  Bottom 0.305: v41.5,57.75 41.5,56 v43.25,54.25
ENC0.!CS
  Bottom 0.305: H13.5 8.26,12.06 8.26,5.25 11.75,1.75 56.25,1.75 59.5,5 59.5,22 58.5,23 58.5,25.95 57.78,26.67 55.88,26.67 U$8.PD6
ENC1.!CS  (via drill 0.36)
  Top 0.305: v65.41,16.51 64.67,17.25 64.25,17.25 58.42,23.08 58.42,23.5 57.78,24.13 55.88,24.13 U$8.PD7
  Bottom 0.305: H14.5 66.67,13.97 65.41,15.24 v65.41,16.51
FET0.D
  Top 0.61: H9.1 9.27,64.14 9.38,64.25 10.38,64.25 10.79,63.84 U$55.PAD@1
  pour Top (no thermals): 10.34,63.1 10.34,63.75 11.88,63.75 11.88,63.35 11.29,63.35 11.29,63.1
FET0.G  (via drill 0.36)
  Top 0.305: U7.9 10.82,56.25 v9.75,56.25 | v9.25,62.75 9.37,62.87 U$55.2
  Bottom 0.305: v9.75,56.25 8.5,57.5 8.5,59.75 9.25,60.5 v9.25,62.75
FET1.D
  Top 0.61: H9.2 10.03,61.59 U$55.PAD@2
  pour Top (no thermals): 11.29,61.9 11.29,62.65 10.29,62.65 10.29,62.4 9.69,62.4 9.69,61.9
FET1.G  (via drill 0.36)
  Top 0.305: U7.10 11.74,55.74 11.5,55.5 v10.5,55.5 | U$55.5 12.38,62.87 v12.5,62.75
  Bottom 0.305: v10.5,55.5 10.5,56.5 9.25,57.75 9.25,59.5 v12.5,62.75
GND  (via drill 0.36)
  Top 0.254: U6.3 22.86,32.45 U6.PAD
  Top 0.305: C16.- 22.08,17.93 v22.23,17.78 | U$118.2 36.7,18.91 v36.2,18.41 | v66.67,21.59 66.19,22.08 C43.- | v66.67,22.86 66.04,22.23 | v65.41,22.86 66.04,22.23 | v65.41,21.59 66.04,22.23 | v1.91,22.86 2.54,22.23 | v3.17,22.86 2.54,22.23 | v3.17,21.59 2.54,22.23 | v1.91,21.59 2.54,22.23 | U11.VSS 55.7,71.05 55.2,71.55 U11.GND@1
  Top 0.406: C29.2 14.93,13.16 U1.7 14.93,16.18 U1.PAD | C28.2 27,13.16 U2.7 27,16.18 U2.PAD | C30.2 42.23,13.16 U3.7 42.23,16.18 U3.PAD | C31.2 54.3,13.16 U4.7 54.3,16.18 U4.PAD | U4.2 53.65,16.84 U4.PAD | U3.2 41.59,16.84 U3.PAD | U2.2 26.34,16.84 U2.PAD | U1.2 14.28,16.84 U1.PAD | U3.12 42.88,17.48 U3.PAD | U1.12 15.58,17.48 U1.PAD | U2.12 27.64,17.48 U2.PAD | U4.12 54.95,17.48 U4.PAD | U7.2 12.39,58.74 U7.PAD 11.74,58.74 U7.6
  other vias: 7.62,1.27 60.96,1.27 22.86,31.75 23.5,31.75 22.23,31.75 21.59,31.75 35.56,30.48 34.92,31.11 34.29,31.75 34.29,30.48 34.92,29.84 33.66,29.84 33.66,31.11 33.02,30.48 33.02,31.75 32.38,31.11 32.38,29.84 31.11,29.84 31.75,30.48 31.11,31.11 30.48,30.48 29.84,29.84 29.21,30.48 29.84,31.11 28.57,31.11 27.94,31.75 29.21,31.75 27.94,30.48 28.57,32.38 27.94,33.02 29.21,33.02 28.57,33.66 29.84,32.38 30.48,33.02 29.84,33.66 29.21,34.29 30.48,34.29 31.11,32.38 29.21,35.56 30.48,35.56 27.94,35.56 27.94,34.29 28.57,36.2 29.84,36.2 30.48,36.83 29.21,36.83 27.94,36.83 34.29,29.21 33.02,29.21 35.56,29.21 36.2,29.84 36.83,29.21 37.47,29.84 36.83,30.48 36.2,31.11 35.56,31.75 36.83,31.75 37.47,31.11 38.1,29.21 38.1,30.48 38.1,31.75 38.73,31.11 38.73,29.84 39.37,30.48 39.37,29.21 40.64,29.21 40.64,30.48 40.64,31.75 40.01,29.84 40.01,31.11 39.37,31.75 40.01,32.38 40.64,33.02 49.53,17.14 48.26,17.14 48.26,17.78 49.53,17.78 22.23,17.14 20.95,17.14 20.95,17.78 13.97,17.14 14.61,16.51 15.24,17.14 15.24,15.88 13.97,15.88 26.04,17.14 27.3,17.14 27.3,15.88 26.04,15.88 26.67,16.51 41.27,17.14 41.91,16.51 42.55,17.14 42.55,15.88 41.27,15.88 53.34,17.14 53.34,15.88 54.61,15.88 53.98,16.51 54.61,17.14 13.97,19.68 26.04,19.68 41.27,19.68 53.34,19.68 6.35,46.35 9.53,51.44 8.89,34.92 8.89,32.38 8.89,29.84 8.89,44.45 8.89,27.3 24.13,13.97 51.44,13.97 35.56,17.78 36.83,17.78 36.83,19.05 35.56,19.05 25.4,27.94 20.75,24.25 27,24.5 40.01,24.77 14.61,26.67 62.87,12.06 59.05,28.57 59.05,31.11 31.11,42.55 32.38,42.55 33.66,42.55 60.75,24 60.33,37.47 59.05,41.91 61.59,43.81 27.75,47 28.75,47 29.75,47 44.25,49 45.25,49 46.25,49 47.25,49 48.25,49 49.25,49 17.27,69.66 17.27,68.77 16.38,68.77 16.38,69.66 11.43,59.05 12.06,58.42 12.7,59.05 12.7,57.78 11.43,57.78 19.05,66.04 20.75,55.5 20.75,57 20.75,58.5 32.38,37.47 33.66,37.47 34.92,37.47 36.2,37.47 43.18,39.37 43.18,38.1 43.18,36.83 43.18,35.56 43.18,34.29 43.18,33.02 43.18,31.75 43.18,30.48 38.5,50 22.86,48.26 40.01,28.57 41.27,28.57 41.27,29.84 41.27,31.11 41.27,32.38 56.75,71.75 53.75,71.75 60.75,71.75 12.06,5.71 13.97,5.71 15.88,5.71 22.23,5.71 24.13,5.71 26.04,5.71 17.78,5.71 20.32,5.71 27.94,5.71 10.16,5.71 30.48,5.71 32.38,5.71 34.29,5.71 36.2,5.71 38.1,5.71 40.64,5.71 42.55,5.71 44.45,5.71 46.35,5.71 48.26,5.71 50.8,5.71 52.7,5.71 54.61,5.71 56.52,5.71 58.42,5.71
  pour Bottom (rank 6): -0.64,0 68.58,0 68.58,76.2 0,76.2
  pour Top (rank 6): 0,0 68.58,0 68.58,76.2 0,76.2
I2C.SCL  (via drill 0.36)
  Top 0.305: U$118.5 35.2,21.7 35.5,22 36.75,22 37.75,23 38.25,23 38.75,23.5 41.75,23.5 43.5,25.25 v50.25,25.25 | U$8.PB2 55.88,44.45 R6.2 52.05,44.45 | 52.05,44.45 v52,44.5 | v31.25,47.75 31.5,48 31.5,49.25 31.66,49.41 U8.23 | 52.05,44.45 51.44,43.84 51.44,41.91 52.5,40.84 52.5,35.25 51,33.75 51,31.5 v50.25,30.75 | U7.15 14.74,58.74 15,59 v15,60 | 25.4,53.1 U$6.3 25.4,53.85 v23.75,55.5 v23.75,60
  Bottom 0.305: v52,44.5 49,47.5 32.5,47.5 32.25,47.75 v31.25,47.75 31,48 31,52.5 28,55.5 v23.75,55.5 | v50.25,25.25 v50.25,30.75 | v23.75,60 v15,60
I2C.SDA  (via drill 0.36)
  Top 0.305: U$118.4 35.7,21.2 36,21.5 37.25,21.5 38.25,22.5 38.75,22.5 39.25,23 42.25,23 43.75,24.5 v49.5,24.5 | v52.25,43 52.21,43.04 R7.2 52.21,42.29 53.25,41.25 53.25,39.28 | v32,47 32,48.6 U8.24 | v49.5,29 51.75,31.25 51.75,33.25 53.25,34.75 53.25,39.28 | 53.25,39.28 U$8.PB3 | U7.16 14.25,59.68 v14.25,60.75 | v23,60.75 v23,54.75 23,52.84 U$6.2
  Bottom 0.305: v52.25,43 48.5,46.75 32.25,46.75 v32,47 31,47 30.5,47.5 30.5,52.25 28,54.75 v23,54.75 | v49.5,24.5 v49.5,29 | v14.25,60.75 v23,60.75
IO0
  Top 0.305: U7.4 10.77,60 9,60 8.05,59.05 H12.1
IO1
  Top 0.305: U7.5 9.39,59.4 6.99,56.98 H12.2
IO2
  Top 0.305: U7.7 9.1,58.09 8.25,57.25 8.25,55.24 H12.3
IO3
  Top 0.305: U7.8 9.45,57.45 9,57 9,53.45 H12.4
M0+
  pour Top (no thermals): 14.5,15 14.5,12 12.5,10 12.5,7.25 12,6.75 11,6.75 10.5,7.25 10.5,10.5 14,14 14,15
M0-
  pour Top (no thermals): 16,15.75 16,12.25 15.5,11.75 15.5,6.75 17.5,6.75 17.5,14.75 17,15.25 17,15.75
M0.DIR  (via drill 0.36)
  Top 0.305: U1.4 11.71,15.54 10.75,16.5 10.75,19.5 v9.75,20.5 | v15.5,34.25 v15.5,41.5 | v27,44.5 v46.5,44.5
  Bottom 0.305: v9.75,20.5 12,20.5 12.5,21 15.75,21 16.5,21.75 16.5,22.25 17,22.75 | 17,22.75 17,23.75 15.5,25.25 v15.5,34.25 | v15.5,41.5 16.25,42.25 16.25,42.75 18,44.5 v27,44.5 | J6.1 20.57,22.18 20,22.75 17,22.75 | U$8.PC4 52.9,38.1 v46.5,44.5
M0.SPD  (via drill 0.36)
  Top 0.305: U1.1 12.25,17.94 v12.25,19.75 | U$8.PD0 12.7,41.91 9.53,41.91 8.26,43.18 5.71,43.18 5.08,42.55 3.81,42.55 3.17,41.91 3.17,26.82 v3.25,26.75 | v5.5,19.75 v7.75,19.75
  Bottom 0.305: v3.25,26.75 5.5,24.5 v5.5,19.75 | v7.75,19.75 v12.25,19.75 13,20.5 16.31,20.5 J5.1
M1+
  pour Top (no thermals): 26.75,15 26.75,11.25 22.25,6.75 21.25,6.75 20.75,7.25 20.75,8.25 26,13.5 26,15
M1-
  pour Top (no thermals): 25.75,8.75 25.75,6.75 27.5,6.75 30,9.25 30,15 29.25,15.75 28.25,15.75 28.25,15.25 28.25,11.25
M1.DIR  (via drill 0.36)
  Top 0.305: U2.4 20.71,15.54 19.75,16.5 v19.75,19.25 | v16.25,33.5 16.25,41.5 v17.25,42.5 | v27.75,43.75 v45.75,43.75
  Bottom 0.305: v19.75,19.25 21.34,20.84 J6.2 21.34,22.41 20.5,23.25 18.5,23.25 16.25,25.5 v16.25,33.5 | v17.25,42.5 18.5,43.75 v27.75,43.75 | v45.75,43.75 47.61,41.89 47.75,41.75 53.94,35.56 U$8.PC5
M1.SPD  (via drill 0.36)
  Top 0.305: U2.1 24.25,18 v24.25,19.75 | U$8.PD1 12.7,39.37 10.79,39.37 7.62,42.55 6.35,42.55 5.71,41.91 5.71,27.54 9.12,24.13 12.06,24.13 12.7,23.5 12.7,22.23 13.68,21.25 v18.75,21.25 v24.5,21.25
  Bottom 0.305: v24.25,19.75 24.25,21 v24.5,21.25 | J5.2 18.5,21.25 v18.75,21.25
M2+
  pour Top (no thermals): 42.25,15 42.25,11.25 43,10.5 43,7.25 42.5,6.75 41.5,6.75 40.75,7.5 40.75,13.5 41.25,14 41.25,15
M2-
  pour Top (rank 2, no thermals): 48,6.75 46,6.75 43.25,9.5 43.25,15.75 44.25,15.75 45.5,14.5 45.5,11 48,8.5
M2.DIR  (via drill 0.36)
  Top 0.305: U3.4 39.22,15.54 38,16.75 v38,19 | v41,21.25 43.5,21.25 43.75,21.5 46,21.5 46.75,22.25 v48.5,22.25 | v48.75,27.5 50,27.5 53.25,30.75 53.25,32.25 54.02,33.02 U$8.PC6
  Bottom 0.305: v38,19 39.75,19 40.25,19.5 40.25,20.5 v41,21.25 | J8.1 48.01,22.51 48.5,23 | v48.75,27.5 48.75,23.25 48.5,23 | v48.5,22.25 48.5,23
M2.SPD  (via drill 0.36)
  Top 0.305: U3.1 39.5,18 v39.5,19.75 | U$8.PA6 12.06,25.4 13.34,24.13 14.61,24.13 15.98,22.75 25.25,22.75 26,22 v28.25,22 | v39.5,21.25 40.25,22 43.25,22 44.25,23 v50,23
  Bottom 0.305: v39.5,21.25 v39.5,19.75 28,19.75 27.5,20.25 27.5,21.25 v28.25,22 | v50,23 50.42,22.58 J7.1
M3+
  pour Top (no thermals): 54,15 54,8.25 52.5,6.75 51.75,6.75 51.25,7.25 51.25,12 53.25,14 53.25,15
M3-
  pour Top (no thermals): 58,14 58,6.75 56.25,6.75 56.25,12.5 55.5,13.25 55.5,15.75 56.25,15.75
M3.DIR  (via drill 0.36)
  Top 0.305: U4.4 50.97,15.54 50.5,16 48,16 47,17 v47,18.5 | U$8.PC7 53.98,30.48 50.24,26.75 v48,26.75
  Bottom 0.305: v48,26.75 48,23.5 47.25,22.75 | 47.25,22.75 J8.2 | v47,18.5 47,22.5 47.25,22.75
M3.SPD  (via drill 0.36)
  Top 0.305: U4.1 51.5,18.06 51.5,19.5 v51.25,19.75 | v16.25,23.5 25.75,23.5 26.5,22.75 v27.75,22.75 | v51,23 50.25,23.75 44,23.75 42.75,22.5 39.5,22.5 v38.75,21.75
  Bottom 0.305: U$8.PA7 12.7,24.13 15.62,24.13 v16.25,23.5 | v27.75,22.75 28.75,22.75 29.5,22 38.5,22 v38.75,21.75 | v51,23 51.18,22.82 J7.2 51.25,21.52 v51.25,19.75
M.EN  (via drill 0.36)
  Top 0.305: U3.3 39.31,16.18 38.75,16.75 v38.75,18.25 38.75,19.5 38,20.25 v38,21.25 | U4.3 51.31,16.18 51,16.5 51,19 50.25,19.75 v43.75,19.75 | U2.3 24.07,16.18 23.75,16.5 23.75,19 23.25,19.5 v23.25,19.75 | U1.3 12.06,16.18 11.5,16.75 11.5,19.75 v9.5,21.75 6.25,25 v6.25,26 | U7.12 13.04,55.04 12,54 v10.5,54 | v15.75,22 v23.75,22 24.75,22 25.5,21.25 v28.75,21.25 29.18,20.82 R2.1
  Bottom 0.305: v10.5,54 8.26,51.76 8.26,46.99 5.71,44.45 5.71,26.54 v6.25,26 | v9.5,21.75 9.75,21.5 15.25,21.5 v15.75,22 | v38,21.25 v28.75,21.25 | v23.25,19.75 23.25,21.25 23.75,21.75 v23.75,22 | v43.75,19.75 42.75,19.75 41.25,18.25 v38.75,18.25
M.MODE  (via drill 0.36)
  Top 0.305: U1.16 13.09,18.41 13,18.5 13,20.5 | U4.16 52.34,18.41 52,18.75 52,20 51.5,20.5 44.77,20.5 | U2.16 25.34,18.41 25,18.75 25,20.5 | U3.16 40.59,18.41 40.25,18.75 40.25,20.5 | U7.11 12.39,55.39 11.75,54.75 v9.75,54.75 | v7,25.25 11.75,20.5 13,20.5 | 44.77,20.5 40.25,20.5 | 40.25,20.5 v38.75,20.5 | v28.25,20.5 25,20.5 | 25,20.5 13,20.5 | R5.2 44.77,20.5
  Bottom 0.305: v9.75,54.75 7.71,52.7 6.35,52.7 5.71,52.07 5.71,46.99 3.17,44.45 3.17,27.94 5.87,25.25 v7,25.25 | v38.75,20.5 v28.25,20.5
N$2  (via drill 0.36)
  Top 0.305: U5.4 36.56,33.69 v36.25,34 | v39,34.75 38.73,35.02 C1.1
  Bottom 0.305: v36.25,34 37,34.75 v39,34.75
N$3
  Top 0.305: R12.2 38.72,26.04 38.25,26.5 37.5,26.5 37.06,26.94 U5.20
N$4  (via drill 0.36)
  Top 0.305: U5.18 36.06,26.81 v35.75,26.5 | v42.25,25.25 42.25,25.55 C11.2 | v42.25,29 v42.25,40.75 | v39,40.75 38.77,40.75 R11.1
  Bottom 0.305: v35.75,26.5 41,26.5 v42.25,25.25 44.25,25.25 44.75,25.75 44.75,26.5 v42.25,29 | v42.25,40.75 v39,40.75
N$5
  Top 0.305: R13.1 37.8,27.3 37.56,27.54 U5.21
N$6  (via drill 0.36)
  Top 0.254: U10.3 19.29,68.72 19.5,68.5 19.5,68 v19.75,67.75
  Top 0.305: LED1.P$1 16.31,74 v16.5,74
  Bottom 0.305: v16.5,74 19.75,70.75 v19.75,67.75
N$7
  Top 0.305: U8.10 37.22,50.41 C33.2
N$8  (via drill 0.36)
  Top 0.305: R10.2 36.38,24.13 v36.5,24.25 | U5.2 37.56,33.56 38,34 v38.5,34
  Bottom 0.305: v36.5,24.25 38,25.75 40.75,25.75 42,24.5 44.5,24.5 45.5,25.5 45.5,26.75 42.25,30 42.25,33.25 41.5,34 v38.5,34
N$9
  Top 0.305: RA2.1 22.79,72.18 LED8.P$2
N$10
  Top 0.305: 40.01,35.26 C13.1 40.01,34.51 38.38,32.88 U5.1
  Top 0.406: R15.2 R16.1 40.28,35.7 C13.1
N$11
  Top 0.305: 38.24,24.77 R8.2 | R9.2 38.24,24.77 | 38.24,24.77 R10.1
N$12
  pour Top (rank 2, no thermals): 23,31.15 23,27.15 24.5,27.15 24.5,30.15 23.5,31.15
N$13
  Top 0.406: U1.11 17.33,16.84 C17.1
N$14
  Top 0.406: C13.2 40.01,37.96 R14.2 39.87,38.38 C12.1
N$15  (via drill 0.36)
  Top 0.305: C1.2 38.73,36.73 v38.5,36.5 | v37,35.5 34.34,35.5 L1.1
  Top 0.406: C1.2 38.73,37.96 R14.1
  Bottom 0.305: v38.5,36.5 37.5,35.5 v37,35.5
  pour Top (no thermals): 36.12,32.27 38.12,34.77 38.37,35.02 38.37,36.27 31.61,36.27 31.61,33.52 32.87,32.27
N$18
  Top 0.406: U1.13 15.58,19.48 C24.2
N$19
  Top 0.406: U2.13 27.64,19.48 C25.2
N$20
  Top 0.406: U3.13 42.88,19.48 C26.2
N$21
  Top 0.406: U4.13 54.95,19.48 C27.2
N$22
  Top 0.305: U$118.10 37.2,15.7 36.45,14.95 R3.1@1
  pour Top (no thermals): 35.81,6.6 37.85,6.6 38.61,7.37 38.61,12.7 36.96,14.35 36.07,14.35 36.07,11.05 35.81,10.79
N$24
  Top 0.305: U8.20 30.5,50.91 C32.1
N$25
  Top 0.406: U2.11 29.39,16.84 C19.1
N$27
  Top 0.406: U3.11 44.63,16.84 C21.1
N$29
  Top 0.406: U4.11 56.7,16.84 C23.1
N$37
  Top 0.406: U3.10 44.63,16.18 C21.2
N$38
  Top 0.406: U1.10 17.33,16.18 C17.2
N$39
  Top 0.406: U2.10 29.39,16.18 C19.2
N$40
  Top 0.406: U4.10 56.7,16.18 C23.2
N$43  (via drill 0.36)
  Top 0.254: U10.6 18.58,70.58 v18.75,70.75
  Top 0.305: LED2.P$1 14.4,74 v14.5,74
  Bottom 0.305: v14.5,74 17.75,70.75 v18.75,70.75
N$44  (via drill 0.36)
  Top 0.254: U10.11 14.21,69.22 v13.25,68.25
  Top 0.305: LED4.P$1 10.6,74 v10.75,74
  Bottom 0.305: v10.75,74 13.25,71.5 v13.25,68.25
N$46
  Top 0.305: RA2.3 21.99,72.48 LED7.P$2
N$47
  Top 0.305: RA2.5 21.19,71.81 20.11,72.89 LED6.P$2
N$48
  Top 0.305: RA2.7 20.39,71.61 20,72 18.66,72 LED5.P$2
N$49
  Top 0.305: RA1.2 10.87,72.18 LED4.P$2
N$50  (via drill 0.36)
  Top 0.254: U10.8 15.53,70.97 v15.5,71
  Top 0.305: LED3.P$1 v12.5,74
  Bottom 0.305: v12.5,74 14.88,71.62 15,71.5 v15.5,71
N$51
  Top 0.305: RA1.8 13.93,72 14.99,72 LED1.P$2
N$52
  Top 0.305: RA1.6 12.46,71.72 13.63,72.89 LED2.P$2
N$53
  Top 0.305: RA1.4 11.66,72.48 LED3.P$2
SPI.FSS  (via drill 0.36)
  Top 0.305: U$8.PA3 60.6,25.4 v60.75,25.25 | v65.25,45.75 61.75,49.25 61.75,50 64.75,53 64.75,67.5 62.75,69.5 60.25,69.5 59.7,70.05 U11.!CS!/NC/DAT3
  Bottom 0.305: v60.75,25.25 62,26.5 62.5,26.5 63.3,27.3 64.77,27.3 65.41,27.94 65.41,45.59 v65.25,45.75
SPI.MISO  (via drill 0.36)
  Top 0.305: H15.4 5.71,9.53 5.71,6.79 11.25,1.25 56.75,1.25 60.75,5.25 v60.75,5.5 | H14.4 64.14,16.51 57.78,22.86 U$8.PA2 | v66.25,26.5 65.41,27.34 65.41,44.45 61,48.85 61,52.25 63.25,54.5 63.25,66 61.25,68 56.75,68 54.7,70.05 U11.MISO/DAT0
  Bottom 0.305: H13.4 3.17,14.61 3.17,12.06 H15.4 | v60.75,5.5 61,5.5 62.87,7.37 62.87,9.53 H16.4 65.41,12.06 65.41,13.97 64.14,15.24 H14.4 64.14,16.51 67.5,19.88 67.5,25.25 v66.25,26.5
SPI.MOSI  (via drill 0.36)
  Top 0.305: H13.6 5.71,14.61 5.71,12.06 H15.6 8.25,9.53 8.25,5.25 11.75,1.75 56.25,1.75 59.5,5 59.5,13.14 60.96,14.61 65.41,14.61 H14.6 | v66.25,45.75 62.5,49.5 v62.5,49.75 | v62.5,51.75 64.25,53.5 64.25,67 62.25,69 59.75,69 58.7,70.05 U11.MOSI/CMD
  Bottom 0.305: U$8.PA5 11.43,27.3 6.99,22.86 H13.6 | v62.5,49.75 v62.5,51.75 | H16.6 68,12.12 68,14.55 H14.6 68,17.2 68,44.5 66.75,45.75 v66.25,45.75
SPI.SCLK  (via drill 0.36)
  Top 0.305: H13.3 3.17,12.06 3.17,9.53 H15.3 | H14.3 65.41,12.06 65.41,9.53 H16.3 | v60.71,26.54 58.55,26.54 U$8.PA4 55.88,29.21 55.88,41.27 56.52,41.91 57.78,41.91 59.05,43.18 59.05,45.72 v59.69,46.35 | v61.75,51 61.75,52 63.75,54 63.75,66.5 61.75,68.5 58.25,68.5 56.7,70.05 U11.CLK
  Bottom 0.305: H15.3 4.45,6.99 10.68,0.75 57.25,0.75 64.14,7.63 | 64.14,7.62 64.14,7.63 | 64.14,7.63 H16.3 | H14.3 62.87,14.61 62.87,16.51 60.5,18.88 60.5,23.07 60,23.57 60,25.75 60.71,26.46 v60.71,26.54 | v59.69,46.35 61.75,48.41 v61.75,51
SVRO0
  Bottom 0.305: H3.1 62.87,40.01 62.87,33.02 62.23,32.38 59.05,32.38 U$8.PB6
SVRO1
  Top 0.305: H3.2 62.87,37.47 62.87,33.02 62.23,32.38 60.96,32.38 60.33,33.02 U$8.PB7
SVRO2  (via drill 0.36)
  Top 0.305: v27.75,26 24,26 23,25 16.5,25 15.5,26 15.5,28.32 v14.61,29.21 | v43,26 43,26.25 43.5,26.75 47,26.75 48.5,28.25 49.75,28.25 52.5,31 52.5,32.81 v53.98,34.29
  Bottom 0.305: U$8.PB4 12.06,30.48 13.34,29.21 v14.61,29.21 | v27.75,26 29,27.25 41.75,27.25 v43,26 | H3.3 59.69,34.29 v53.98,34.29
SVRO3  (via drill 0.36)
  Top 0.305: U$8.PB5 12.7,44.45 16.3,44.45 v16.5,44.25 | v26.25,45.25 v47.25,45.25 | H3.4 v59.05,36.2
  Bottom 0.305: v16.5,44.25 17.5,45.25 v26.25,45.25 | 47.5,45 v47.25,45.25 53.13,39.37 55.24,39.37 55.88,38.73 55.88,37.47 56.52,36.83 58.42,36.83 v59.05,36.2
SVRO4/ENC2.!CS
  Bottom 0.305: U$8.PE4 10.16,34.29 10.16,27.3 6.35,23.5 6.35,17.14 5.71,16.51 5.71,9.53 H15.5 6.99,5.51 11.25,1.25 56.75,1.25 60,4.5 60,22.5 59.25,23.25 59.25,26.09 60.46,27.3 62.23,27.3 62.87,27.94 62.87,29.84 H3.5
SVRO5/ENC3.!CS  (via drill 0.36)
  Top 0.305: v27,26.75 23.75,26.75 22.75,25.75 16.75,25.75 16.25,26.25 16.25,28.5 15.25,29.5 15.25,31.11 v14.61,31.75 | v62,25.25 62,28.17 H3.6 | v44,26 50.5,26 53.71,29.21 v53.98,29.21 | H16.5 68,9.58 68,23.5 v66.25,25.25
  Bottom 0.305: U$8.PE5 12.06,33.02 13.34,31.75 v14.61,31.75 | v27,26.75 28,27.75 42.5,27.75 44,26.25 v44,26 | H3.6 60.33,29.84 58.42,29.84 57.78,29.21 v53.98,29.21 | v62,25.25 v66.25,25.25
UART.RXI  (via drill 0.36)
  Top 0.305: U$7.3 26.67,51.44 28.57,51.44 29.25,52.11 v29.25,55.25 29.25,55.75 31.5,58 v31.75,58 | v25.25,57 25.25,60.5 20.5,65.25 20.5,68.25 19.5,69.25 19.5,69.5 19.29,69.72 U10.5
  Bottom 0.305: U$8.PB0 12.7,39.37 15.37,39.37 19,43 28.25,43 28.5,43.25 28.5,44 25.4,47.1 U$7.3 | H23.3 38.31,51.44 v31.75,58 | v29.25,55.25 28.25,56.25 26,56.25 v25.25,57
UART.TXO  (via drill 0.36)
  Top 0.254: U10.2 18.58,67.67 v18.75,67.5
  Top 0.305: v26.67,53.34 26.67,53.92 v31.75,59 | v21.5,54.75 21.5,61.25 v19.75,63
  Bottom 0.254: 40.77,52.44 39.77,52.44
  Bottom 0.305: U$8.PB1 12.06,38.1 13.34,36.83 14.61,36.83 15.5,37.73 15.5,38.25 19.5,42.25 28.5,42.25 29.25,43 29.25,44.25 26,47.5 26,49 26.67,49.67 26.67,50.8 26.04,51.44 | 26.04,51.44 24.13,51.44 U$7.2 21.59,51.44 21.59,54.66 v21.5,54.75 | H23.4 41.27,52.44 40.77,52.44 | 39.77,52.44 38.31,52.44 v31.75,59 | 26.04,51.44 26.67,52.07 v26.67,53.34 | v18.75,67.5 19.75,66.5 v19.75,63
VBAT  (via drill 0.36)
  Top 0.305: U$118.9 U$118.8 36.2,15.7 34.67,14.17 R3.2@1 | U5.17 35.5,28.02 35.5,27.75 | 35,25.5 35.1,25.4 R8.1 36.56,25.91 U5.19
  Top 0.406: C29.1 15.58,13.13 U1.8 | C28.1 27.64,13.13 U2.8 | C30.1 42.88,13.13 U3.8 | C31.1 54.95,13.13 U4.8
  Top 0.61: C29.1 15.24,11.93 v15.24,10.79 | C28.1 27.3,11.93 v27.3,11.43 v27.3,10.79 | C30.1 42.55,11.93 v42.55,11.43 v42.55,10.79 | C31.1 54.61,11.93 v54.61,11.43 v54.61,10.79
  Top 1.27: C10.1 26.67,29.82 26.67,41.27 18.41,49.53 18.41,59.05 10.79,66.67 H27.2
  other vias: 15.24,11.43 22.23,11.43 20.95,11.43 48.26,11.43 49.53,11.43 34.29,11.43 34.29,10.79 33.66,11.43 33.66,10.79 33.02,11.43 33.02,10.79 32.38,11.43 31.75,11.43 31.75,10.79 32.38,10.79 21.59,11.43 48.9,11.43
  pour Top (no thermals): 27.81,29.02 35.62,29.02 35.62,26.27 27.81,26.27
  pour Top (rank 3, no thermals): 20.5,15 20.5,10.75 22.75,10.75 22.75,15
  pour Top (rank 3, no thermals): 47.75,15 47.75,10.75 50,10.75 50,15
  pour Bottom: 55.24,11.43 55.24,10.79 arc-90 54.61,10.16 15.24,10.16 arc-90 14.61,10.79 14.61,11.43 arc-90 15.24,12.06 54.61,12.06 arc-90
  pour Top (rank 2, no thermals): 35.56,15.88 35.56,10.16 30.48,10.16 30.48,23.75 27.81,26.41 35.52,26.41 35.52,24.77 33,22.25 33.02,18.41
VIN
  Top 1.27: H8.1 H8.2 H27.1
XBEE.ASSOCIATE  (via drill 0.36)
  Top 0.305: LED6.P$1 20.12,74 v20.25,74 | v44.25,54.5 45.75,54.5 46.75,55.5 46.75,61 47.5,61.75 61.75,61.75 v62,61.5 | v39.5,65.25 38.5,66.25 32.75,66.25 30.25,68.75 30.25,72.5 29.75,73 26,73 v25.75,72.75
  Bottom 0.305: U13.15 63.95,61.5 v62,61.5 | v44.25,54.5 42.25,56.5 42.25,58.75 40.5,60.5 40.5,64.25 v39.5,65.25 | v25.75,72.75 25.5,72.5 24.5,72.5 23,74 v20.25,74
XBEE.RSSI  (via drill 0.36)
  Top 0.305: LED5.P$1 18.21,74 v18.25,74 | v40.75,65.25 39.25,66.75 33,66.75 30.75,69 30.75,72.75 30,73.5 25,73.5 v24.75,73.25
  Bottom 0.305: v40.75,65.25 41.5,66 43.67,66 U13.6 | v24.75,73.25 23.25,74.75 20,74.75 19.25,74 v18.25,74
XBEE.RXI
  Top 0.305: U13.2 43.5,71.05 43.5,57.66 41.5,55.66 41.5,54.66 H23.1
XBEE.TXO
  Top 0.305: U13.3 46.25,69.06 46.25,56 45.5,55.25 43.25,55.25 42.27,54.27 H23.2

### Text on the board
tDocu: VIN | VBAT | 5 | Factory / RST | 4 | 3 | 2 | 3.3v | SDA | SCL | GND | 1 | I2C | XBee | RST | GND | 0 | UART | Bluetooth | GPIO | 3.3v | TxO | RxI | GND | RxI | TxO | - | + | + | - | ~ | ~ | 3.3v | 5v | 5 | 5 | 4 | 4 | 3 | 3 | 2 | 2 | 1 | 1 | 0 | 0 | ADC | SERVO | ENC 0|2 | ENC 1|3 | 0 | 1 | 2 | 3 | - | + | - | + | - | + | - | + | - | + | M0 | M1 | VBAT | M2 | M3
bDocu: 3.3v | 5v | RxI | TxO | RSSI | Associate | Status | Connect | Robotics / Booster Pack | VIN | VBAT | Cruz Monrreal II | AnomalousMaker.com | 5 | 4 | 3 | 2 | 3.3v | SDA | SCL | GND | 1 | I2C | XBee | RST | GND | 0 | UART | Bluetooth | GPIO | 3.3v | TxO | RxI | GND | RxI | TxO | - | + | + | - | ~ | ~ | 3.3v | 5v | 5 | 5 | 4 | 4 | 3 | 3 | 2 | 2 | 1 | 1 | 0 | 0 | ADC | SERVO | 1 || 2 | 1 || 2 | ENC 0|2 | ENC 1|3 | GND | MISO | MOSI | GND | MISO | MOSI | 3.3v | SCLK | CS | 3.3v | SCLK | CS | - | + | - | + | - | + | - | + | - | + | M0 | M1 | VBAT | M2 | M3